# Altium schematic sheet 02 CONNECTION.SchDoc
size 420 x 297 mm
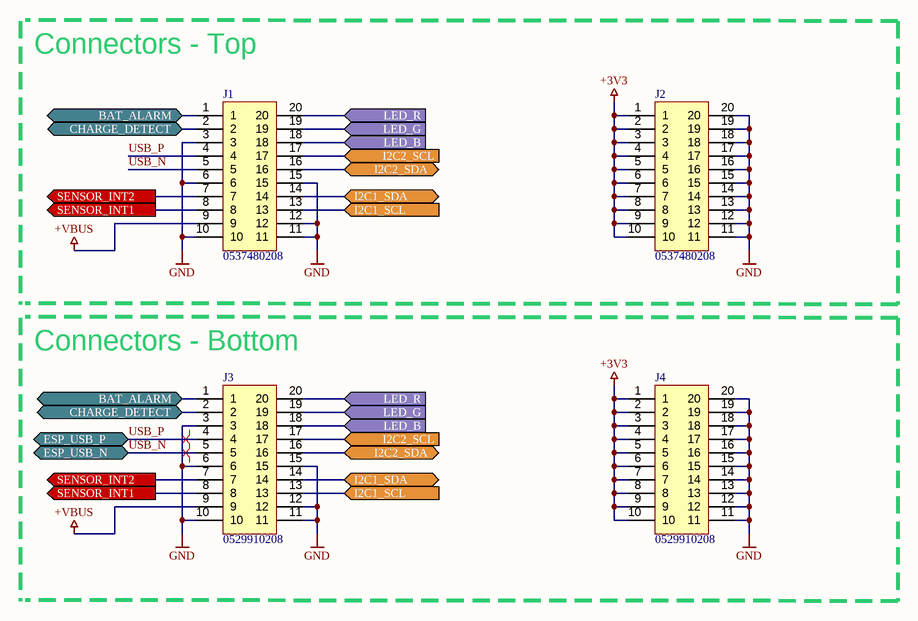
[diagram p0: 02 CONNECTION.SchDoc]

## Parts
J1  0537480208  [0537480208]
J2  0537480208  [0537480208]
J3  0529910208  [0529910208]
J4  0529910208  [0529910208]

## Ports
BAT_ALARM (bidir), CHARGE_DETECT (bidir), ESP_USB_N (bidir), ESP_USB_P (bidir), I2C1_SCL (in), I2C1_SDA (bidir), I2C2_SCL (in), I2C2_SDA (bidir), LED_B (in), LED_G (in), LED_R (in), SENSOR_INT1 (out), SENSOR_INT2 (out)

## Nets
+3V3: J2.1 J2.2 J2.3 J2.4 J2.5 J2.6 J2.7 J2.8 J2.9 J2.10 J4.1 J4.2 J4.3 J4.4 J4.5 J4.6 J4.7 J4.8 J4.9 J4.10
+VBUS: J1.9 J3.9
GND: J1.3 J1.6 J1.10 J1.11 J1.12 J1.15 J2.11 J2.12 J2.13 J2.14 J2.15 J2.16 J2.17 J2.18 J2.19 J2.20 J3.3 J3.6 J3.10 J3.11 J3.12 J3.15 J4.11 J4.12 J4.13 J4.14 J4.15 J4.16 J4.17 J4.18 J4.19 J4.20
BAT_ALARM: J1.1 J3.1 ; port BAT_ALARM
CHARGE_DETECT: J1.2 J3.2 ; port CHARGE_DETECT
I2C1_SCL: J1.13 J3.13 ; port I2C1_SCL
I2C1_SDA: J1.14 J3.14 ; port I2C1_SDA
I2C2_SCL: J1.17 J3.17 ; port I2C2_SCL
I2C2_SDA: J1.16 J3.16 ; port I2C2_SDA
LED_B: J1.18 J3.18 ; port LED_B
LED_G: J1.19 J3.19 ; port LED_G
LED_R: J1.20 J3.20 ; port LED_R
SENSOR_INT1: J1.8 J3.8 ; port SENSOR_INT1
SENSOR_INT2: J1.7 J3.7 ; port SENSOR_INT2
USB_N: J1.5 J3.5 ; port ESP_USB_N
USB_P: J1.4 J3.4 ; port ESP_USB_P

## Layout directives
differential pair; differential pair class USB: USB_N, USB_P

## Notes on the sheet
- Connectors - Top
- (near J3) Connectors - Bottom
- Title
- Project
- Size
- Date
- Revision
- A3

## Library data of the parts
J1 J2 = 0537480208: CONN PLUG 20POS SMD GOLD; manufacturer: MOLEX; assembler_number: C564063; mfr_part_number: 0537480208; datasheet: https://datasheet.lcsc.com/lcsc/2206301915_MOLEX-537480208_C564063.pdf
J3 J4 = 0529910208: CONN PLUG 20POS SMD GOLD; manufacturer: MOLEX; mfr_part_number: 0529910208; datasheet: https://www.molex.com/pdm_docs/sd/529910208_sd.pdf